# EAGLE design sistema min (EAGLE 7.6.0)
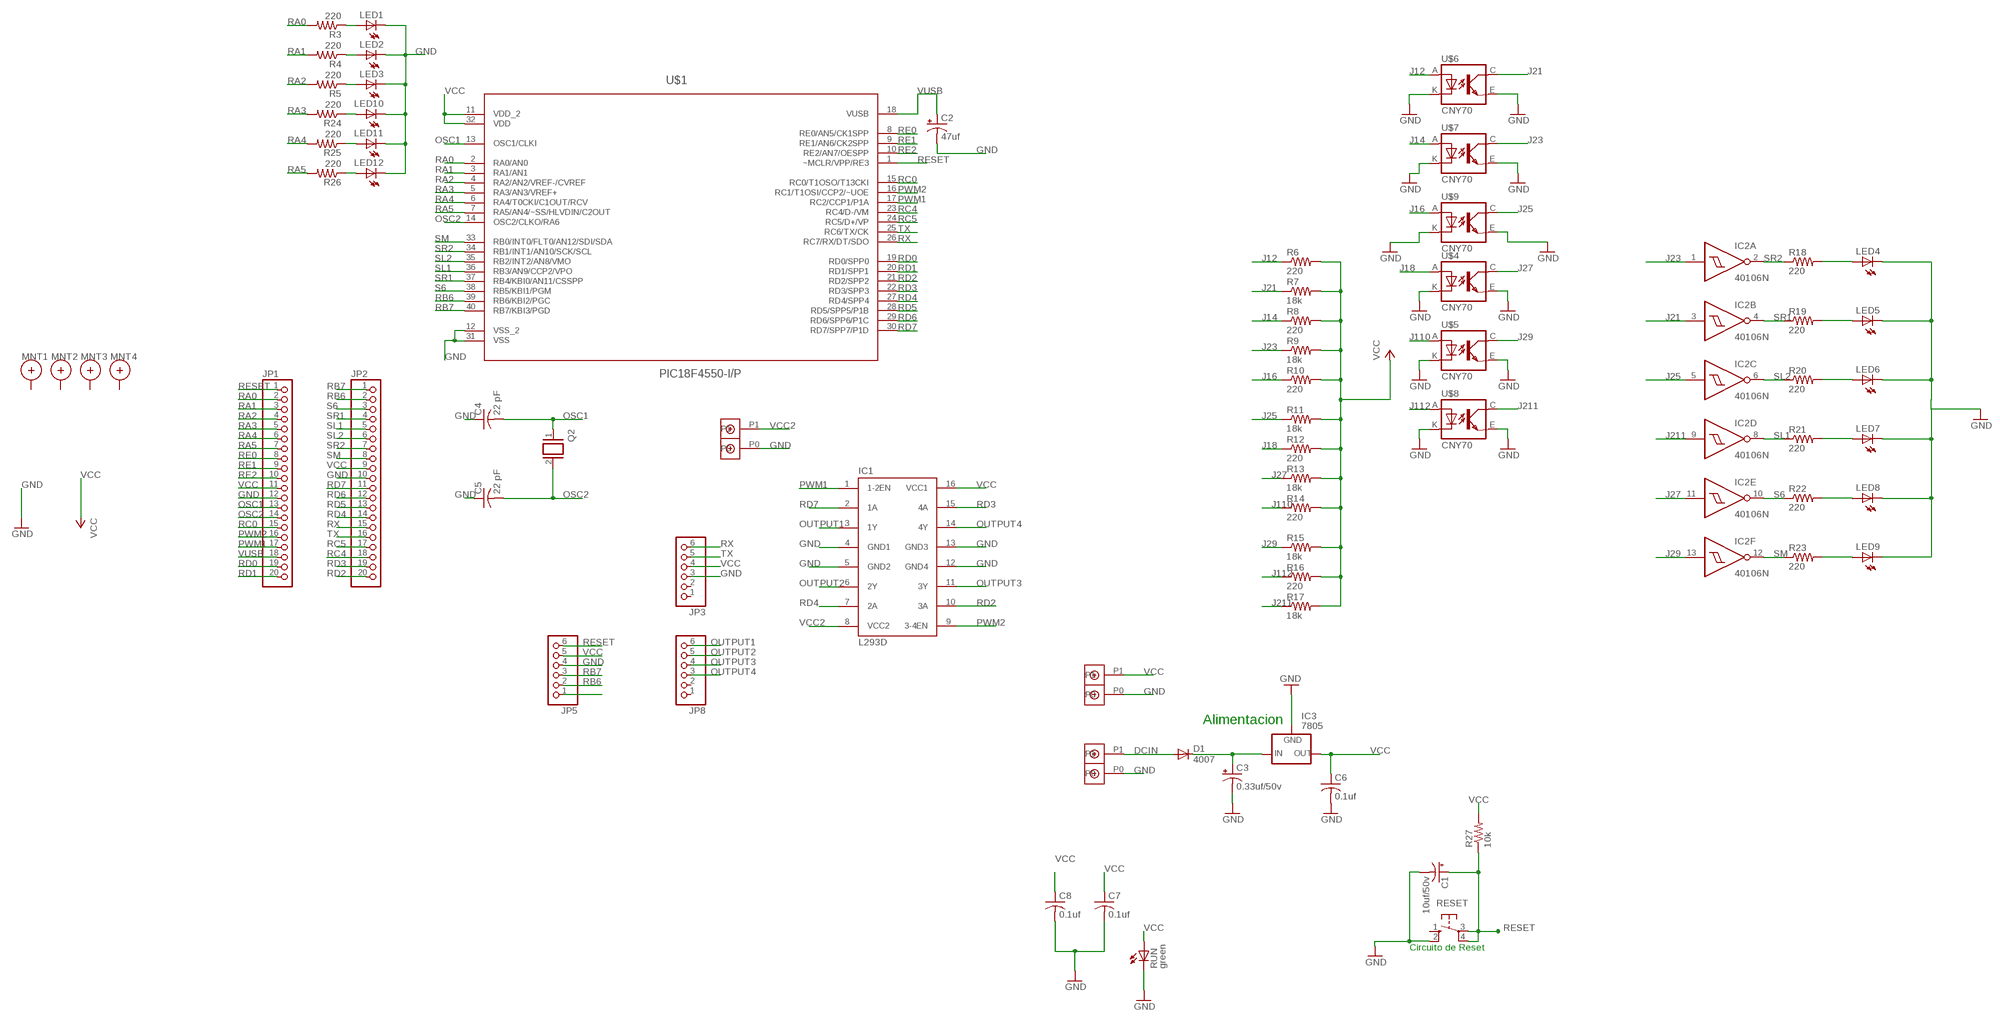
[diagram p0: schematic, sheet 1]

## Parts
C1  10uf/50v  CPOL-US153CLV-0505  [153CLV-0505]
C2  47uf  CPOL-US153CLV-0605  [153CLV-0605]
C3  0.33uf/50v  CPOL-US153CLV-0405  [153CLV-0405]
C4  22 pF  C-USC1206  [C1206]
C5  22 pF  C-USC1206  [C1206]
C6  0.1uf  C-USC1206  [C1206]
C7  0.1uf  C-USC1206  [C1206]
C8  0.1uf  C-USC1206  [C1206]
D1  4007  1N4148DO35-7  [DO35-7]
IC1  L293D  [DIL16]
IC2  40106N  [DIL14]
IC3  7805  79XXS  [79XXS]
JP1  PINHD-1X20  [1X20]
JP2  PINHD-1X20  [1X20]
JP3  PINHD-1X6  [1X06]
JP5  PINHD-1X6  [1X06]
JP8  PINHD-1X6  [1X06]
LED1  LEDCHIPLED_1206  [CHIPLED_1206]
LED2  LEDCHIPLED_1206  [CHIPLED_1206]
LED3  LEDCHIPLED_1206  [CHIPLED_1206]
LED4  LEDCHIPLED_1206  [CHIPLED_1206]
LED5  LEDCHIPLED_1206  [CHIPLED_1206]
LED6  LEDCHIPLED_1206  [CHIPLED_1206]
LED7  LEDCHIPLED_1206  [CHIPLED_1206]
LED8  LEDCHIPLED_1206  [CHIPLED_1206]
LED9  LEDCHIPLED_1206  [CHIPLED_1206]
LED10  LEDCHIPLED_1206  [CHIPLED_1206]
LED11  LEDCHIPLED_1206  [CHIPLED_1206]
LED12  LEDCHIPLED_1206  [CHIPLED_1206]
MNT1  HOLE_MNT_0.135  [HOLE_MNT_#5-40]
MNT2  HOLE_MNT_0.135  [HOLE_MNT_#5-40]
MNT3  HOLE_MNT_0.135  [HOLE_MNT_#5-40]
MNT4  HOLE_MNT_0.135  [HOLE_MNT_#5-40]
Q2  XTAL/S  [QS]
R3  220  R-US_M1206  [M1206]
R4  220  R-US_M1206  [M1206]
R5  220  R-US_M1206  [M1206]
R6  220  R-US_M1206  [M1206]
R7  18k  R-US_M1206  [M1206]
R8  220  R-US_M1206  [M1206]
R9  18k  R-US_M1206  [M1206]
R10  220  R-US_M1206  [M1206]
R11  18k  R-US_M1206  [M1206]
R12  220  R-US_M1206  [M1206]
R13  18k  R-US_M1206  [M1206]
R14  220  R-US_M1206  [M1206]
R15  18k  R-US_M1206  [M1206]
R16  220  R-US_M1206  [M1206]
R17  18k  R-US_M1206  [M1206]
R18  220  R-US_M1206  [M1206]
R19  220  R-US_M1206  [M1206]
R20  220  R-US_M1206  [M1206]
R21  220  R-US_M1206  [M1206]
R22  220  R-US_M1206  [M1206]
R23  220  R-US_M1206  [M1206]
R24  220  R-US_M1206  [M1206]
R25  220  R-US_M1206  [M1206]
R26  220  R-US_M1206  [M1206]
R27  10k  R-US_R1206  [R1206]
RESET  10-XX  [B3F-10XX]
RUN  green  LEDSML1206  [SML1206]
U$1  PIC18F4550-I/P  [DIP254P1524X635-40]
U$2  DBCONN-1X2  [DBCONN-1X2]
U$3  DBCONN-1X2  [DBCONN-1X2]
U$4  CNY70  [4]
U$5  CNY70  [4]
U$6  CNY70  [4]
U$7  CNY70  [4]
U$8  CNY70  [4]
U$9  CNY70  [4]
U$10  DBCONN-1X2  [DBCONN-1X2]

## Nets
DCIN: D1.A U$2.P1
GND: C1.- C2.- C3.- C4.1 C5.1 C6.2 C7.2 C8.2 IC1.4(GND1) IC1.5(GND2) IC1.12(GND4) IC1.13(GND3) IC3.GND JP1.12 JP2.10 JP3.3 JP5.4 LED1.C LED2.C LED3.C LED4.C LED5.C LED6.C LED7.C LED8.C LED9.C LED10.C LED11.C LED12.C RESET.2(S1) RUN.C U$1.12(VSS_2) U$1.31(VSS) U$2.P0 U$3.P0 U$4.E(EMI) U$4.K(C) U$5.E(EMI) U$5.K(C) U$6.E(EMI) U$6.K(C) U$7.E(EMI) U$7.K(C) U$8.E(EMI) U$8.K(C) U$9.E(EMI) U$9.K(C) U$10.P0
J12: R6.1 U$6.A
J14: R8.1 U$7.A
J16: R10.1 U$9.A
J18: R12.1 U$4.A
J21: IC2.3(B:I) R7.1 U$6.C(COL)
J23: IC2.1(A:I) R9.1 U$7.C(COL)
J25: IC2.5(C:I) R11.1 U$9.C(COL)
J27: IC2.11(E:I) R13.1 U$4.C(COL)
J29: IC2.13(F:I) R15.1 U$5.C(COL)
J110: R14.1 U$5.A
J112: R16.1 U$8.A
J211: IC2.9(D:I) R17.1 U$8.C(COL)
N$1: LED4.A R18.2
N$2: LED10.A R24.1
N$4: LED1.A R3.1
N$5: LED11.A R25.1
N$6: LED2.A R4.1
N$7: LED3.A R5.1
N$8: LED12.A R26.1
N$10: JP5.1
N$11: LED5.A R19.2
N$12: LED6.A R20.2
N$13: LED7.A R21.2
N$14: LED8.A R22.2
N$15: LED9.A R23.2
N$17: C3.+ D1.C IC3.IN
OSC1: C4.2 JP1.13 Q2.1 U$1.13(OSC1/CLKI)
OSC2: C5.2 JP1.14 Q2.2 U$1.14(OSC2/CLKO/RA6)
OUTPUT1: IC1.3(1Y) JP8.6
OUTPUT2: IC1.6(2Y) JP8.5
OUTPUT3: IC1.11(3Y) JP8.4
OUTPUT4: IC1.14(4Y) JP8.3
PWM1: IC1.1(1-2EN) JP1.17 U$1.17(RC2/CCP1/P1A)
PWM2: IC1.9(3-4EN) JP1.16 U$1.16(RC1/T1OSI/CCP2/~UOE)
RA0: JP1.2 R3.2 U$1.2(RA0/AN0)
RA1: JP1.3 R4.2 U$1.3(RA1/AN1)
RA2: JP1.4 R5.2 U$1.4(RA2/AN2/VREF-/CVREF)
RA3: JP1.5 R24.2 U$1.5(RA3/AN3/VREF+)
RA4: JP1.6 R25.2 U$1.6(RA4/T0CKI/C1OUT/RCV)
RA5: JP1.7 R26.2 U$1.7(RA5/AN4/~SS/HLVDIN/C2OUT)
RB6: JP2.2 JP5.2 U$1.39(RB6/KBI2/PGC)
RB7: JP2.1 JP5.3 U$1.40(RB7/KBI3/PGD)
RC0: JP1.15 U$1.15(RC0/T1OSO/T13CKI)
RC4: JP2.18 U$1.23(RC4/D-/VM)
RC5: JP2.17 U$1.24(RC5/D+/VP)
RD0: JP1.19 U$1.19(RD0/SPP0)
RD1: JP1.20 U$1.20(RD1/SPP1)
RD2: IC1.10(3A) JP2.20 U$1.21(RD2/SPP2)
RD3: IC1.15(4A) JP2.19 U$1.22(RD3/SPP3)
RD4: IC1.7(2A) JP2.14 U$1.27(RD4/SPP4)
RD5: JP2.13 U$1.28(RD5/SPP5/P1B)
RD6: JP2.12 U$1.29(RD6/SPP6/P1C)
RD7: IC1.2(1A) JP2.11 U$1.30(RD7/SPP7/P1D)
RE0: JP1.8 U$1.8(RE0/AN5/CK1SPP)
RE1: JP1.9 U$1.9(RE1/AN6/CK2SPP)
RE2: JP1.10 U$1.10(RE2/AN7/OESPP)
RESET: C1.+ JP1.1 JP5.6 R27.1 RESET.3(P) RESET.4(P1) U$1.1(~MCLR/VPP/RE3)
RX: JP2.15 JP3.6 U$1.26(RC7/RX/DT/SDO)
S6: IC2.10(E:O) JP2.3 R22.1 U$1.38(RB5/KBI1/PGM)
SL1: IC2.8(D:O) JP2.5 R21.1 U$1.36(RB3/AN9/CCP2/VPO)
SL2: IC2.6(C:O) JP2.6 R20.1 U$1.35(RB2/INT2/AN8/VMO)
SM: IC2.12(F:O) JP2.8 R23.1 U$1.33(RB0/INT0/FLT0/AN12/SDI/SDA)
SR1: IC2.4(B:O) JP2.4 R19.1 U$1.37(RB4/KBI0/AN11/CSSPP)
SR2: IC2.2(A:O) JP2.7 R18.1 U$1.34(RB1/INT1/AN10/SCK/SCL)
TX: JP2.16 JP3.5 U$1.25(RC6/TX/CK)
VCC: C6.1 C7.1 C8.1 IC1.16(VCC1) IC3.OUT JP1.11 JP2.9 JP3.4 JP5.5 R6.2 R7.2 R8.2 R9.2 R10.2 R11.2 R12.2 R13.2 R14.2 R15.2 R16.2 R17.2 R27.2 RUN.A U$1.11(VDD_2) U$1.32(VDD) U$10.P1
VCC2: IC1.8(VCC2) U$3.P1
VUSB: C2.+ JP1.18 U$1.18(VUSB)
Unconnected: JP3.1 JP3.2 JP8.1 JP8.2 MNT1.P$1 MNT2.P$1 MNT3.P$1 MNT4.P$1 RESET.1(S)

## Notes on the sheet
- Alimentacion
- Circuito de Reset

## Power pins joined to a net without a drawn wire
VDD: IC2.14(P:VDD)
VSS: IC2.7(P:VSS)

## Library data of the parts
C1-C3 = rcl:CPOL-US: POLARIZED CAPACITOR, American symbol
C4-C8 = rcl:C-US: CAPACITOR, American symbol
D1 = diode:1N4148: DIODE high speed (Philips)
IC1 = st-microelectronics:L293D: PUSH-PULL 4 CHANNEL DRIVER; MPN: L293D; OC_FARNELL: 9589619; OC_NEWARK: 56P8249
IC2 = 40xx:40106: Hex SCHMITT TRIGGER
IC3 = v-reg:79XXS: VOLTAGE REGULATOR
JP1 JP2 = pinhead:PINHD-1X20: PIN HEADER
JP3 JP5 JP8 = pinhead:PINHD-1X6: PIN HEADER
LED1-LED12 RUN = led:LED: LED OSRAM: - CHIPLED LG R971, LG N971, LY N971, LG Q971, LY Q971, LO R971, LY R971 LH N974, LH R974 LS Q976, LO Q976, LY Q976 LO Q996 - Hyper CHIPLED LW Q18S LB Q993, LB Q99A, LB R99A - SideLED LS A670, LO A670, LY A670, LG A670, LP A670 LB A673, LV A673, LT A673, LW A673 LH A674 LY A675 LS A676, LA A676, LO A676, LY A676, LW A676 LS A679, LY A679, LG A679 - Hyper Micro SIDELED® LS Y876, LA Y876, LO Y876, LY Y876 LT Y87S - SmartLED LW L88C, LW L88S LB L89C, LB L89S, LG L890 LS L89K, LO L89K, LY L89K LS L896, LA L896, LO L896, LY L896 - TOPLED LS T670, LO T670, LY T670, LG T670, LP T670 LSG T670, LSP T670, LSY T670, LOP T670, LYG T670 LG T671, LOG T671, LSG T671 LB T673, LV T673, LT T673, LW T673 LH T674 LS T676, LA T676, LO T676, LY T676, LB T676, LH T676, LSB T676, LW T676 LB T67C, LV T67C, LT T67C, LS T67K, LO T67K, LY T67K, LW E67C LS E67B, LA E67B, LO E67B, LY E67B, LB E67C, LV E67C, LT E67C LW T67C LS T679, LY T679, LG T679 LS T770, LO T770, LY T770, LG T770, LP T770 LB T773, LV T773, LT T773, LW T773 LH T774 LS E675, LA E675, LY E675, LS T675 LS T776, LA T776, LO T776, LY T776, LB T776 LHGB T686 LT T68C, LB T68C - Hyper Mini TOPLED® LB M676 - Mini TOPLED Santana® LG M470 LS M47K, LO M47K, LY M47K Source: http://www.osram.convergy.de LUXEON: - LUMILED® LXK2-PW12-R00, LXK2-PW12-S00, LXK2-PW14-U00, LXK2-PW14-V00 LXK2-PM12-R00, LXK2-PM12-S00, LXK2-PM14-U00 LXK2-PE12-Q00, LXK2-PE12-R00, LXK2-PE12-S00, LXK2-PE14-T00, LXK2-PE14-U00 LXK2-PB12-K00, LXK2-PB12-L00, LXK2-PB12-M00, LXK2-PB14-N00, LXK2-PB14-P00, LXK2-PB14-Q00 LXK2-PR12-L00, LXK2-PR12-M00, LXK2-PR14-Q00, LXK2-PR14-R00 LXK2-PD12-Q00, LXK2-PD12-R00, LXK2-PD12-S00 LXK2-PH12-R00, LXK2-PH12-S00 LXK2-PL12-P00, LXK2-PL12-Q00, LXK2-PL12-R00 Source: www.luxeon.com KINGBRIGHT: KA-3528ASYC Source: www.kingbright.com
MNT1-MNT4 = Existing Library:HOLE_MNT_0.135: Mounting Hole. 0.135 plated hole created for a #5-40 screw, McMaster p/n 91772A125
Q2 = special:XTAL/S: CRYSTAL
R3-R27 = rcl:R-US_: RESISTOR, American symbol
RESET = switch-omron:10-XX: OMRON SWITCH; MPN: B3F-1000; OC_FARNELL: 176432; OC_NEWARK: 36M3542
U$1 = Microchip_By_element14_Batch_1:PIC18F4550-I/P: USB Microcontrollers; DESCRIPTION: USB Microcontrollers; MPN: PIC18F4550-I/P; OC_FARNELL: 9321357; OC_NEWARK: 74K8623; PACKAGE: DIP-40; SUPPLIER: Microchip
U$2 U$3 U$10 = Terminal Block Connector:DBCONN-1X2
U$4-U$9 = cny70:CNY70

## Board
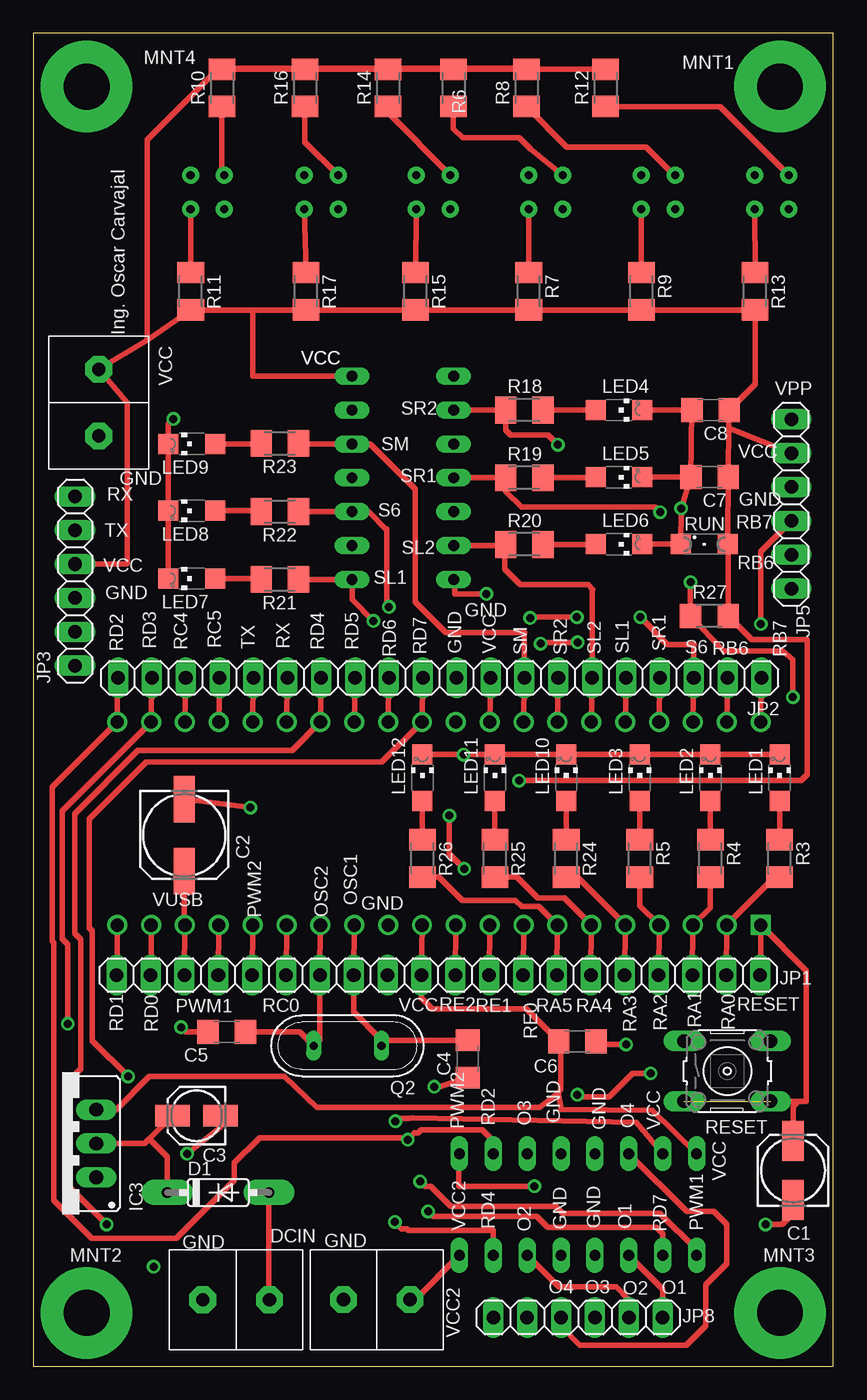
[diagram p1: board, top side]
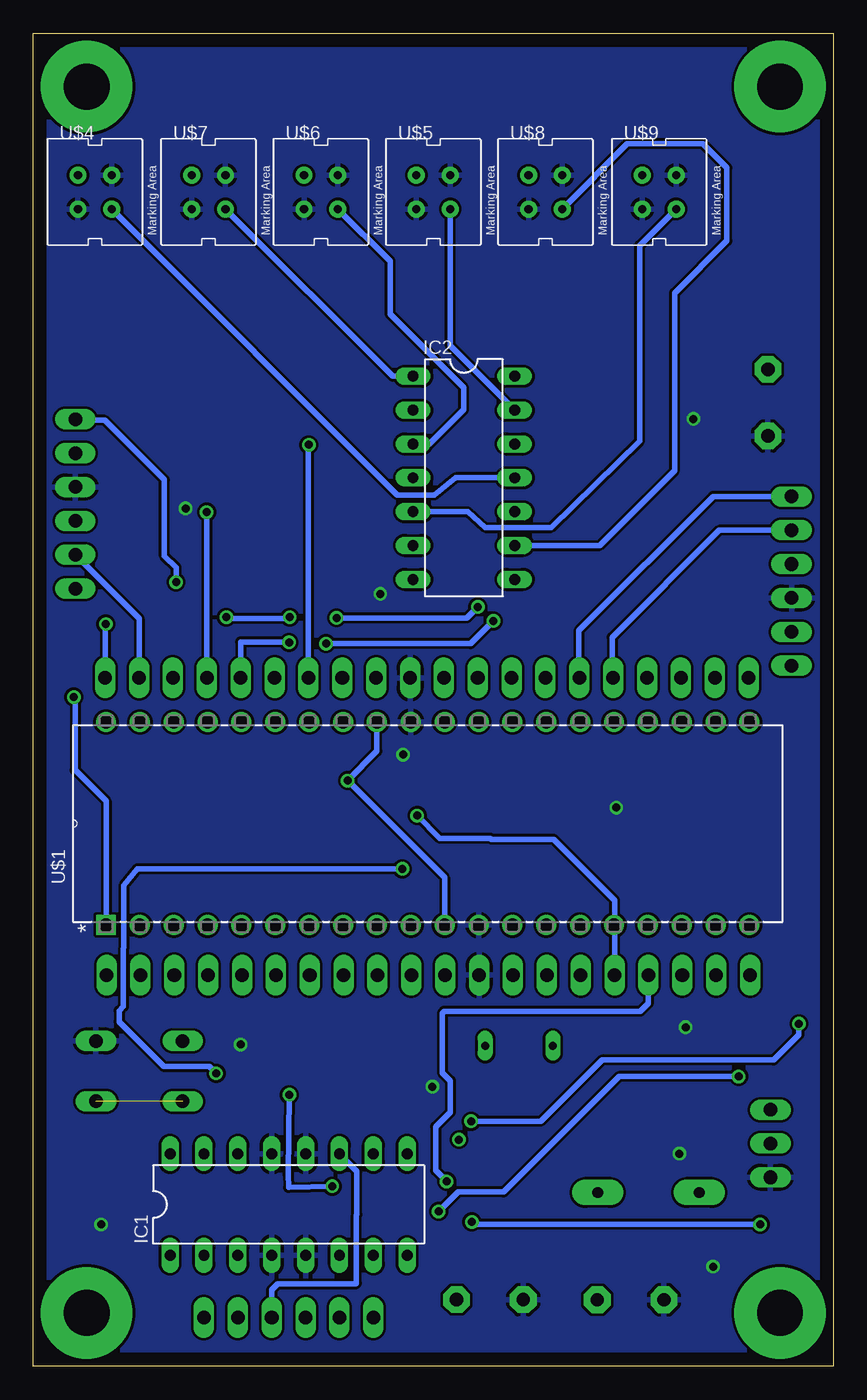
[diagram p2: board, bottom side, seen from below]

Size 60 x 100 mm. Coordinates in mm from the lower left corner, seen from the top.
Outline: 0,0 60,0 60,100 0,100 0,0
Copper layers (1*16): Top 0.035mm / dielectric 1.5mm / Bottom 0.035mm
Design rules "default": minimum track width 10mil, minimum drill 24mil, track to track 8mil, track to pad 8mil, pad to pad 8mil, via to via 8mil, smd to smd 8mil, copper to edge 40mil, drill to drill 8mil, minimum pad ring 10mil, minimum via ring 8mil, stop-mask expansion 4mil, vias tented up to drill 0mil, thermal gap 10mil

### Footprints (pad centres in the part's own frame; a part is rotated, then mirrored left to right if it is on the bottom)
153CLV-0505 = smd 3 x 1.6: + 2.2,0; - -2.2,0
153CLV-0605 = smd 3.5 x 1.6: + 2.7,0; - -2.7,0
153CLV-0405 = smd 2.6 x 1.6: + 1.8,0; - -1.8,0
C1206 = smd 1.6 x 1.8: 1 -1.4,0; 2 1.4,0
DO35-7 = drill 0.813 pad 1.93 long: A 3.81,0; C -3.81,0
DIL16 = drill 0.813 long: 1 -8.89,-3.81; 2 -6.35,-3.81; 3 -3.81,-3.81; 4 -1.27,-3.81; 5 1.27,-3.81; 6 3.81,-3.81; 7 6.35,-3.81; 8 8.89,-3.81; 9 8.89,3.81; 10 6.35,3.81; 11 3.81,3.81; 12 1.27,3.81; 13 -1.27,3.81; 14 -3.81,3.81; 15 -6.35,3.81; 16 -8.89,3.81
DIL14 = drill 0.813 long: 1 -7.62,-3.81; 2 -5.08,-3.81; 3 -2.54,-3.81; 4 0,-3.81; 5 2.54,-3.81; 6 5.08,-3.81; 7 7.62,-3.81; 8 7.62,3.81; 9 5.08,3.81; 10 2.54,3.81; 11 0,3.81; 12 -2.54,3.81; 13 -5.08,3.81; 14 -7.62,3.81
79XXS = drill 1.016 long: GND -2.54,-2.54; IN 0,-2.54; OUT 2.54,-2.54
1X20 = drill 1.016 long: 1 -24.13,0; 2 -21.59,0; 3 -19.05,0; 4 -16.51,0; 5 -13.97,0; 6 -11.43,0; 7 -8.89,0; 8 -6.35,0; 9 -3.81,0; 10 -1.27,0; 11 1.27,0; 12 3.81,0; 13 6.35,0; 14 8.89,0; 15 11.43,0; 16 13.97,0; 17 16.51,0; 18 19.05,0; 19 21.59,0; 20 24.13,0
1X06 = drill 1.016 long: 1 -6.35,0; 2 -3.81,0; 3 -1.27,0; 4 1.27,0; 5 3.81,0; 6 6.35,0
CHIPLED_1206 = smd 1.5 x 1.5: A 0,-1.75; C 0,1.75
HOLE_MNT_#5-40 = drill 3.429 pad 6.858: P$1 0,0
QS = drill 0.61 long: 1 -2.54,0; 2 2.54,0
M1206 = smd 1.6 x 2: 1 -1.4,0; 2 1.4,0
R1206 = smd 1.6 x 1.803: 1 -1.422,0; 2 1.422,0
B3F-10XX = drill 1.016 long: 1 -3.251,2.261; 2 3.251,2.261; 3 -3.251,-2.261; 4 3.251,-2.261
SML1206 = smd 1.5 x 1.5: A 1.75,0; C -1.75,0
DIP254P1524X635-40 = drill 0.991 square: 1 -15.24,48.26 | drill 0.991: 2 -15.24,45.72; 3 -15.24,43.18; 4 -15.24,40.64; 5 -15.24,38.1; 6 -15.24,35.56; 7 -15.24,33.02; 8 -15.24,30.48; 9 -15.24,27.94; 10 -15.24,25.4; 11 -15.24,22.86; 12 -15.24,20.32; 13 -15.24,17.78; 14 -15.24,15.24; 15 -15.24,12.7; 16 -15.24,10.16; 17 -15.24,7.62; 18 -15.24,5.08; 19 -15.24,2.54; 20 -15.24,0; 21 0,0; 22 0,2.54; 23 0,5.08; 24 0,7.62; 25 0,10.16; 26 0,12.7; 27 0,15.24; 28 0,17.78; 29 0,20.32; 30 0,22.86; 31 0,25.4; 32 0,27.94; 33 0,30.48; 34 0,33.02; 35 0,35.56; 36 0,38.1; 37 0,40.64; 38 0,43.18; 39 0,45.72; 40 0,48.26
DBCONN-1X2 = drill 1 pad 2 octagon: P0 -2.54,0; P1 2.46,0
4 = drill 0.61 pad 1.27: A -1.27,1.27; C 1.27,-1.27; E 1.27,1.27; K -1.27,-1.27

### Placement (x,y rotation side)
C1  56.98,14.7 90 top
C2  11.32,39.84 270 top
C3  12.24,18.79 180 top
C4  32.58,23.06 90 top
C5  14.51,25.08 0 top
C6  40.81,24.38 0 top
C7  50.72,66.71 180 top
C8  50.79,71.73 180 top
D1  13.86,13.03 0 top
IC1  40.85,12.13 0 bottom
IC2  27.71,66.65 270 bottom
IC3  2.18,16.71 90 top
JP1  30.38,29.34 180 top
JP2  30.48,51.64 180 top
JP3  3.13,58.91 90 top
JP5  56.85,64.69 90 top
JP8  40.85,3.66 0 top
LED1  55.97,44.14 0 top
LED2  50.78,44.14 0 top
LED3  45.48,44.14 0 top
LED4  43.92,71.73 270 top
LED5  43.92,66.69 270 top
LED6  43.92,61.67 270 top
LED7  11.88,59.1 90 top
LED8  11.88,64.18 90 top
LED9  11.88,69.19 90 top
LED10  39.97,44.14 0 top
LED11  34.62,44.14 0 top
LED12  29.18,44.14 0 top
MNT1  56,96 0 top
MNT2  4,4 0 top
MNT3  56,4 0 top
MNT4  4,96 0 top
Q2  23.57,24.04 180 top
R3  55.97,38.09 270 top
R4  50.78,38.09 270 top
R5  45.48,38.09 270 top
R6  31.5,95.9 90 top
R7  37.16,80.64 270 top
R8  36.99,95.9 90 top
R9  45.61,80.64 270 top
R10  14.14,95.9 90 top
R11  11.8,80.64 270 top
R12  42.92,95.9 90 top
R13  54.13,80.64 270 top
R14  26.6,95.9 90 top
R15  28.67,80.64 270 top
R16  20.37,95.9 90 top
R17  20.45,80.64 270 top
R18  36.83,71.73 0 top
R19  36.83,66.65 0 top
R20  36.83,61.65 0 top
R21  18.49,59.03 180 top
R22  18.49,64.12 180 top
R23  18.49,69.25 180 top
R24  39.97,38.09 270 top
R25  34.62,38.09 270 top
R26  29.18,38.09 270 top
R27  50.7,56.28 0 top
RESET  52.05,22.14 0 top
RUN  50.32,61.67 0 top
U$1  6.29,48.33 90 bottom
U$2  15.25,4.98 0 top
U$3  25.8,4.99 0 top
U$4  55.38,88.09 0 bottom
U$5  30,88.09 0 bottom
U$6  38.43,88.09 0 bottom
U$7  46.86,88.09 0 bottom
U$8  21.59,88.09 0 bottom
U$9  13.06,88.09 0 bottom
U$10  4.91,72.33 90 top

### Tracks (layer width: path | path; a pad name or v marks a point on that pad's centre or on a via)
DCIN
  Top 0.406: D1.A 17.67,7.1 U$2.P1
GND  (via drill 0.6)
  Top 0.406: C7.2 C8.2 LED4.C | C7.2 LED5.C | C7.2 v48.58,64.35 RUN.C LED6.C | v10.5,71.07 10.13,70.7 LED9.C LED8.C LED7.C | LED12.C v32.27,45.88 LED11.C LED10.C LED3.C LED2.C LED1.C | v11.54,15.95 14.05,17.97 C3.- | v30.07,20.96 30.44,20.96 C4.1 | v54.92,10.64 56.16,10.64 57.22,11.7 57.22,12.26 C1.- | v44.46,24.14 42.45,24.14 C6.2 | C5.1 11.43,25.08 v11.08,25.43 | v16.28,41.91 14.19,42.19 C2.-
  other vias: 9.02,7.46 33.98,57.94
  pour Bottom: 0.46,99.55 59.32,99.55 59.32,97.66 59.47,97.66 59.47,0.61 0.56,0.61 0.56,0.46 0.41,0.46 0.41,99.55
J12
  Top 0.406: U$6.A 37.31,91.29 36.44,92.16 32.19,92.16 31.5,92.85 R6.1
J14
  Top 0.406: U$7.A 48.07,89.36 45.96,91.47 40.02,91.47 R8.1
J16
  Top 0.406: U$9.A 14.14,89.36 R10.1
J18
  Top 0.406: U$4.A 51.51,94.5 R12.1
J21
  Top 0.406: R7.1 U$6.C
  Bottom 0.406: IC2.3 30.29,69.19 27.72,71.76 27.72,73.41 33.25,78.94 33.25,82.91 U$6.C
J23
  Top 0.406: R9.1 U$7.C
  Bottom 0.406: IC2.1 33.04,74.27 U$7.C
J25
  Top 0.406: R11.1 U$9.C
  Bottom 0.406: IC2.5 27.43,64.11 26.1,62.92 21.16,62.92 14.53,69.41 14.53,84.08 U$9.C
J27
  Top 0.406: R13.1 U$4.C
  Bottom 0.406: IC2.11 28.32,66.65 29.93,65.36 32.69,65.36 U$4.C
J29
  Top 0.406: R15.1 U$5.C
  Bottom 0.406: IC2.13 28.73,76.56 U$5.C
J110
  Top 0.406: U$5.A 26.6,94.03 R14.1
J112
  Top 0.406: U$8.A 20.37,91.85 R16.1
J211
  Top 0.406: R17.1 U$8.C
  Bottom 0.406: IC2.9 17.53,61.57 11.9,67.2 11.9,80.51 7.98,84.43 7.98,89.9 9.78,91.7 15.44,91.7 U$8.C
N$1
  Top 0.406: LED4.A R18.2
N$2
  Top 0.406: LED10.A R24.1
N$3
  Top 0.406: 23.98,74.29 16.46,74.29 16.46,79.22
N$4
  Top 0.406: LED1.A R3.1
N$5
  Top 0.406: LED11.A R25.1
N$6
  Top 0.406: LED2.A R4.1
N$7
  Top 0.406: LED3.A R5.1
N$8
  Top 0.406: LED12.A R26.1
N$9
  Top 0.406: 34.03,57.94 31.59,57.94 31.59,59.09
N$11
  Top 0.406: LED5.A 42.13,66.65 R19.2
N$12
  Top 0.406: LED6.A 42.15,61.65 R20.2
N$13
  Top 0.406: R21.2 17.02,59.1 LED7.A
N$14
  Top 0.406: R22.2 17.03,64.18 LED8.A
N$15
  Top 0.406: R23.2 17.03,69.19 LED9.A
N$17
  Top 0.406: IC3.IN 8.36,16.71 8.7,17.05 | 8.7,17.05 C3.+ | D1.C 10.05,15.7 8.7,17.05
OSC1
  Top 0.406: U$1.13 JP1.13 24.02,26.58 26.11,24.49 Q2.1 26.53,24.46 C4.2
OSC2
  Top 0.406: U$1.14 JP1.14 21.49,24.5 Q2.2 19.99,25.08 C5.2
OUTPUT1
  Top 0.406: JP8.6 47.2,5.78 IC1.3
OUTPUT2
  Top 0.406: JP8.5 44.66,4.99 43.71,5.94 39.42,5.94 IC1.6
OUTPUT3
  Bottom 0.406: JP8.4 42.12,5.73 41.68,6.17 35.83,6.17 35.78,6.22 35.78,11.33 35.73,11.38 35.73,14.63 IC1.11
OUTPUT4
  Top 0.406: JP8.3 39.58,2.98 40.99,1.57 48.97,1.57 50.44,3.04 50.44,6.12 52.01,7.69 52.01,10.64 51.04,11.61 48.99,11.61 IC1.14
PWM1  (via drill 0.6)
  Top 0.406: JP1.17 U$1.17 | IC1.1 49.74,8.72 46.99,11.47 39.7,11.47 39.19,11.98 31.31,11.98 29.79,13.5 29.36,13.5 v29,13.86
  Bottom 0.406: JP1.17 13.87,27.23 14.48,26.62 29.19,26.62 29.33,26.48 29.33,22.02 28.73,21.42 28.73,19.06 29.83,17.96 29.83,14.69 v29,13.86
PWM2  (via drill 0.6)
  Top 0.406: JP1.16 U$1.16 | v31.21,41.31 31.21,38.42 v32.32,37.31 | v46.29,21.97 44.95,21.97 43.2,20.22 40.94,20.22 v40.8,20.36 | v37.58,13.5 31.91,13.5 IC1.9
  Bottom 0.406: JP1.16 16.41,34.95 20.98,39.52 25.64,39.52 25.73,39.61 29.51,39.61 v31.21,41.31 | v32.32,37.31 52.19,37.31 53.21,36.06 53.21,31.46 53.25,31.27 53.25,26.99 53.57,26.67 53.57,25.84 50.21,22.48 46.8,22.48 v46.29,21.97 | v40.8,20.36 40.89,14.38 40.85,13.41 v37.58,13.5
RA0
  Top 0.406: JP1.2 U$1.2 55.61,36.69 R3.2
RA1
  Top 0.406: JP1.3 U$1.3 50.78,34.4 R4.2
RA2
  Top 0.406: JP1.4 U$1.4 45.48,34.54 R5.2
RA3
  Top 0.406: JP1.5 U$1.5 40.79,36.69 R24.2
RA4
  Top 0.406: JP1.6 U$1.6 39.8,35.14 37.82,35.14 36.27,36.69 R25.2
RA5
  Top 0.406: JP1.7 U$1.7 37.9,34.5 36.62,34.5 36.16,34.96 32.15,34.96 30.42,36.69 R26.2
RB6
  Top 0.406: JP2.2 U$1.39
  Bottom 0.406: JP5.2 52.07,56.1 JP2.2
RB7  (via drill 0.6)
  Top 0.406: JP2.1 U$1.40 | JP5.3 54.56,61.13 v54.56,55.68
  Bottom 0.406: v54.56,55.68 54.61,55.63 JP2.1
RC0
  Top 0.406: 19.19,29.43 JP1.15 U$1.15
RC4
  Top 0.406: JP2.18 U$1.23
RC5
  Top 0.406: JP2.17 U$1.24
RD0
  Top 0.406: JP1.19 8.83,29.38 U$1.19
RD1
  Top 0.406: JP1.20 6.29,29.38 U$1.20
RD2  (via drill 0.6)
  Top 0.406: JP2.20 6.29,51.58 U$1.21 1.43,43.47 1.43,31.87 1.52,31.78 1.52,12.44 4.38,9.58 10.7,9.58 15.08,13.96 15.08,15.24 16.97,17.13 28.21,17.13 | IC1.10 34.5,16.89 33.66,17.73 29.1,17.73 28.87,17.5 28.58,17.5 28.45,17.36 28.21,17.13 | 28.21,17.13 v28.08,17
RD3  (via drill 0.6)
  Top 0.406: JP2.19 U$1.22 2.17,41.67 2.17,32.06 2.58,31.65 v2.58,25.7 | IC1.15 45.22,18.3 28.41,18.65 28.17,18.61 27.39,18.61 v27.16,18.38
  Bottom 0.406: v2.58,25.7 2.58,24.87 4.47,22.98 17.35,22.98 21.95,18.38 v27.16,18.38
RD4  (via drill 0.6)
  Top 0.406: JP2.14 U$1.27 19.4,46.2 7.84,46.2 3.09,41.45 3.09,32.47 3.55,32.01 3.55,22.29 2.54,21.28 2.54,13.59 v5.49,10.64 | IC1.7 34.5,10.17 34.49,10.18 28.13,10.18 27.99,10.32 27.61,10.32 v27.11,10.82
  Bottom 0.406: v5.49,10.64 26.93,10.64 v27.11,10.82
RD5
  Top 0.406: JP2.13 U$1.28
RD6
  Top 0.406: JP2.12 U$1.29
RD7  (via drill 0.6)
  Top 0.406: JP2.11 U$1.30 26.14,45.32 8.48,45.32 4.2,41.04 4.2,32.89 4.43,32.66 4.43,24.41 v7.1,21.74 | IC1.2 47.2,9.92 46.71,10.41 38.59,10.41 37.76,11.24 29.97,11.24 v29.6,11.61
  Bottom 0.406: v7.1,21.74 16.06,21.74 24.72,13.08 28.13,13.08 v29.6,11.61
RE0
  Top 0.406: U$1.8 JP1.8
RE1
  Top 0.406: U$1.9 JP1.9
RE2
  Top 0.406: U$1.10 JP1.10
RESET  (via drill 0.6)  (1 unrouted)
  Top 0.406: 57.37,19.88 57.95,19.88 57.97,19.9 57.97,29.67 U$1.1 54.55,29.38 JP1.1 | 57.37,19.88 RESET.4 | v56.96,50.2 56.96,53.01 56.19,53.67 51.78,53.67 R27.1 49.28,58.8 v49.3,58.82 | C1.+ 56.98,19.49 57.37,19.88
  Bottom 0.406: v56.96,50.2 56.87,50.11 56.87,44.72 54.55,42.4 U$1.1 | v49.3,58.82 49.3,59.92 50.18,60.8 50.18,66.51 54.65,70.98 56.79,70.98 JP5.6
RX
  Top 0.406: JP2.15 U$1.26
  Bottom 0.406: JP3.6 9.01,65.26 19.09,55.18 19.09,51.68 JP2.15
S6  (via drill 0.6)
  Top 0.406: R22.1 IC2.10 25.14,64.11 26.47,62.78 26.48,62.78 26.52,62.82 26.52,57.11 v26.66,56.97 | U$1.38 JP2.3 49.53,54.11 49.58,54.16 47.55,54.16 v45.52,56.19 | v37.26,56.15 37.3,56.19 v40.77,56.19
  Bottom 0.406: v26.66,56.97 27.48,56.15 v37.26,56.15 | v40.77,56.19 40.86,56.1 45.7,56.1 45.61,56.19 v45.52,56.19
SL1  (via drill 0.6)
  Top 0.406: R21.1 IC2.8 23.9,57.51 v25.5,55.91 | JP2.5 U$1.36 | v38.05,54.21 38.14,54.3 v40.82,54.3
  Bottom 0.406: v25.5,55.91 27.2,54.21 v38.05,54.21 | v40.82,54.3 40.87,54.35 44.46,54.35 44.45,54.34 JP2.5
SL2
  Top 0.406: R20.1 35.35,61.57 | 35.35,61.57 IC2.6 | U$1.35 JP2.6 41.91,58.2 41.97,58.26 41.6,58.63 36.53,58.63 35.35,59.81 35.35,61.57
SM
  Top 0.406: R23.1 19.95,69.19 IC2.12 25.27,69.19 28.64,65.82 28.64,57.34 30.94,55.04 36.85,55.04 36.83,55.02 JP2.8 U$1.33
SR1  (via drill 0.6)
  Top 0.406: IC2.4 R19.1 35.43,65.63 36.62,64.44 46.63,64.44 v47,64.07 | JP2.4 U$1.37
  Bottom 0.406: v47,64.07 v46.99,64.06 JP2.4
SR2  (via drill 0.6)
  Top 0.406: IC2.2 R18.1 35.43,70.23 35.79,69.87 38.6,69.87 v39.34,69.13 | JP2.7 U$1.34
  Bottom 0.406: v39.34,69.13 39.37,69.1 JP2.7
TX
  Top 0.406: JP2.16 U$1.25
  Bottom 0.406: JP3.5 8.55,62.72 16.6,54.67 16.6,51.73 JP2.16
VCC  (via drill 0.6)
  Top 0.406: R10.2 R16.2 R14.2 R6.2 R8.2 | R8.2 R12.2 | 8.55,76.97 U$10.P1 7.06,72.28 7.06,60.24 7,60.18 JP3.4 | 8.55,76.97 R11.2 R17.2 R15.2 R7.2 R9.2 R13.2 54.13,73.67 C8.1 52.17,70.39 | 52.17,70.39 52.13,67.25 | 52.13,67.25 C7.1 | 52.13,67.25 RUN.A 52.12,61.62 R27.2 53.87,54.53 58.02,54.53 58.06,54.49 58.06,44.4 57.6,43.94 v36.43,43.94 | JP5.5 52.17,70.39 | R8.2 36.92,97.37 13.92,97.37 8.55,92 8.55,76.97 | JP2.9 U$1.32 | U$1.11 JP1.11 29.11,27.62 29.92,26.81 36.98,26.81 C6.1 39.56,24.23 39.56,20.73 39.35,20.52 | IC3.OUT 6.22,19.25 8.71,21.74 18.81,21.74 21.25,19.43 37.99,19.43 39.35,20.52 | 39.35,20.52 39.59,19.26 46.41,19.21 IC1.16
  Bottom 0.406: U$1.32 34.23,46.14 v36.43,43.94 29.15,36.66 U$1.11
VCC2
  Top 0.406: U$3.P1 28.63,4.99 IC1.8
VUSB
  Top 0.406: JP1.18 U$1.18 11.32,33.14 C2.+

### Text on the board
tNames: Ing. Oscar Carvajal | VCC | VCC | VCC | VPP | SR2 | SM | VCC | GND | SR1 | RX | GND | S6 | RB7 | TX | SL2 | VCC | RB6 | SL1 | GND | GND | RD2 | RD3 | RC4 | RC5 | TX | RX | RD4 | RD5 | SR1 | S6 | RB6 | RD6 | RD7 | GND | VCC | SM | SR2 | SL2 | SL1 | RB7 | PWM2 | OSC2 | VUSB | OSC1 | GND | PWM1 | RC0 | VCC | RE2 | RE1 | RA5 | RA4 | RESET | RE0 | RD1 | RD0 | RA3 | RA2 | RA1 | RA0 | PWM2 | RD2 | O3 | GND | GND | O4 | VCC | VCC | GND | DCIN | GND | VCC2 | RD4 | O2 | GND | GND | O1 | RD7 | PWM1 | O4 | O3 | O2 | O1 | VCC2